# Altium schematic sheet jms578.SchDoc
size A2; SheetNumber: 2; SheetTotal: 4
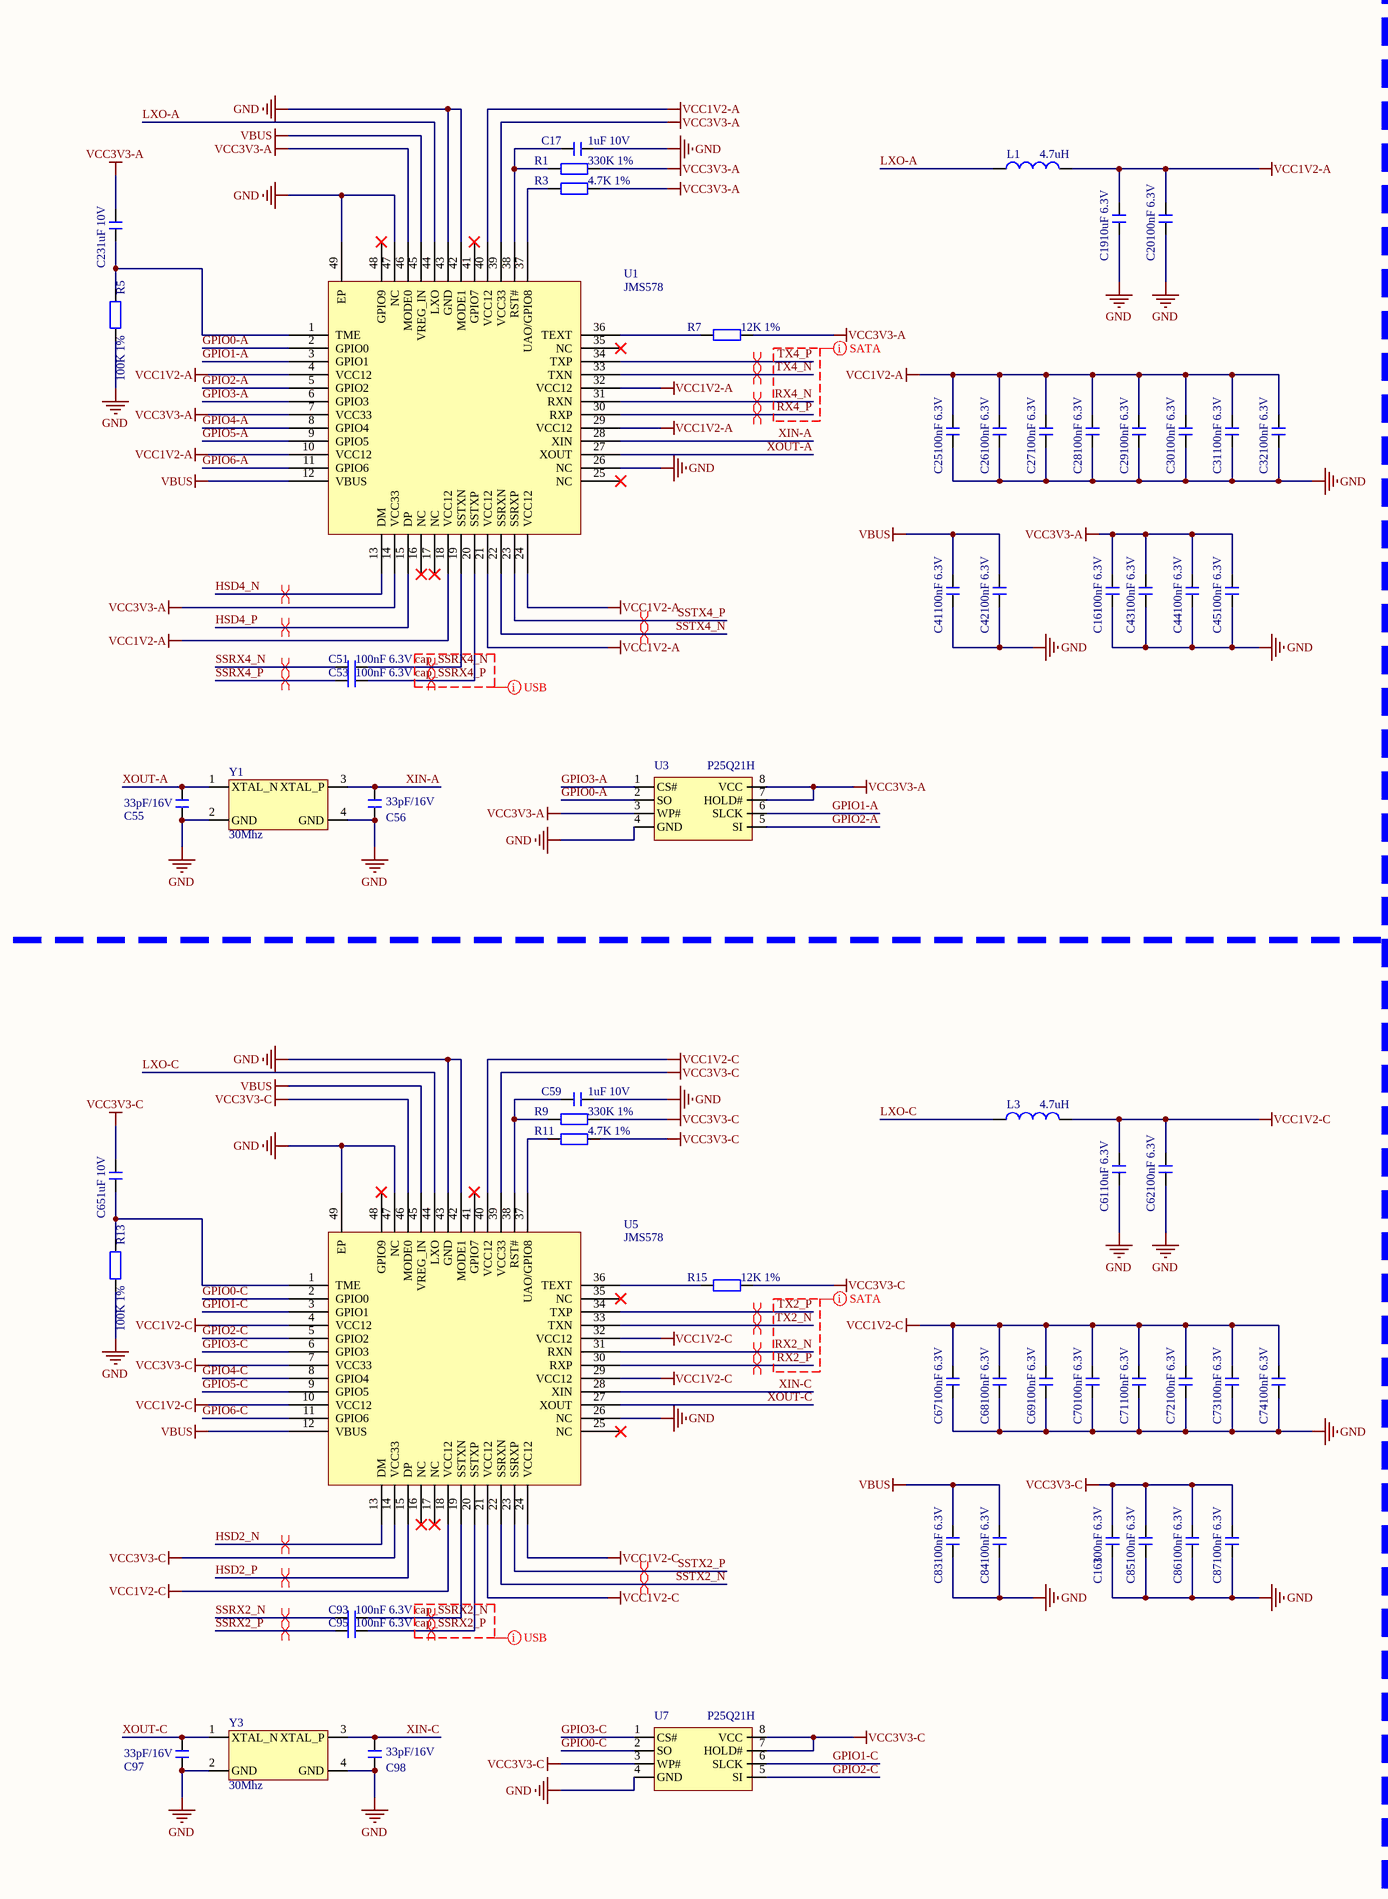
[diagram p0: jms578.SchDoc, left]
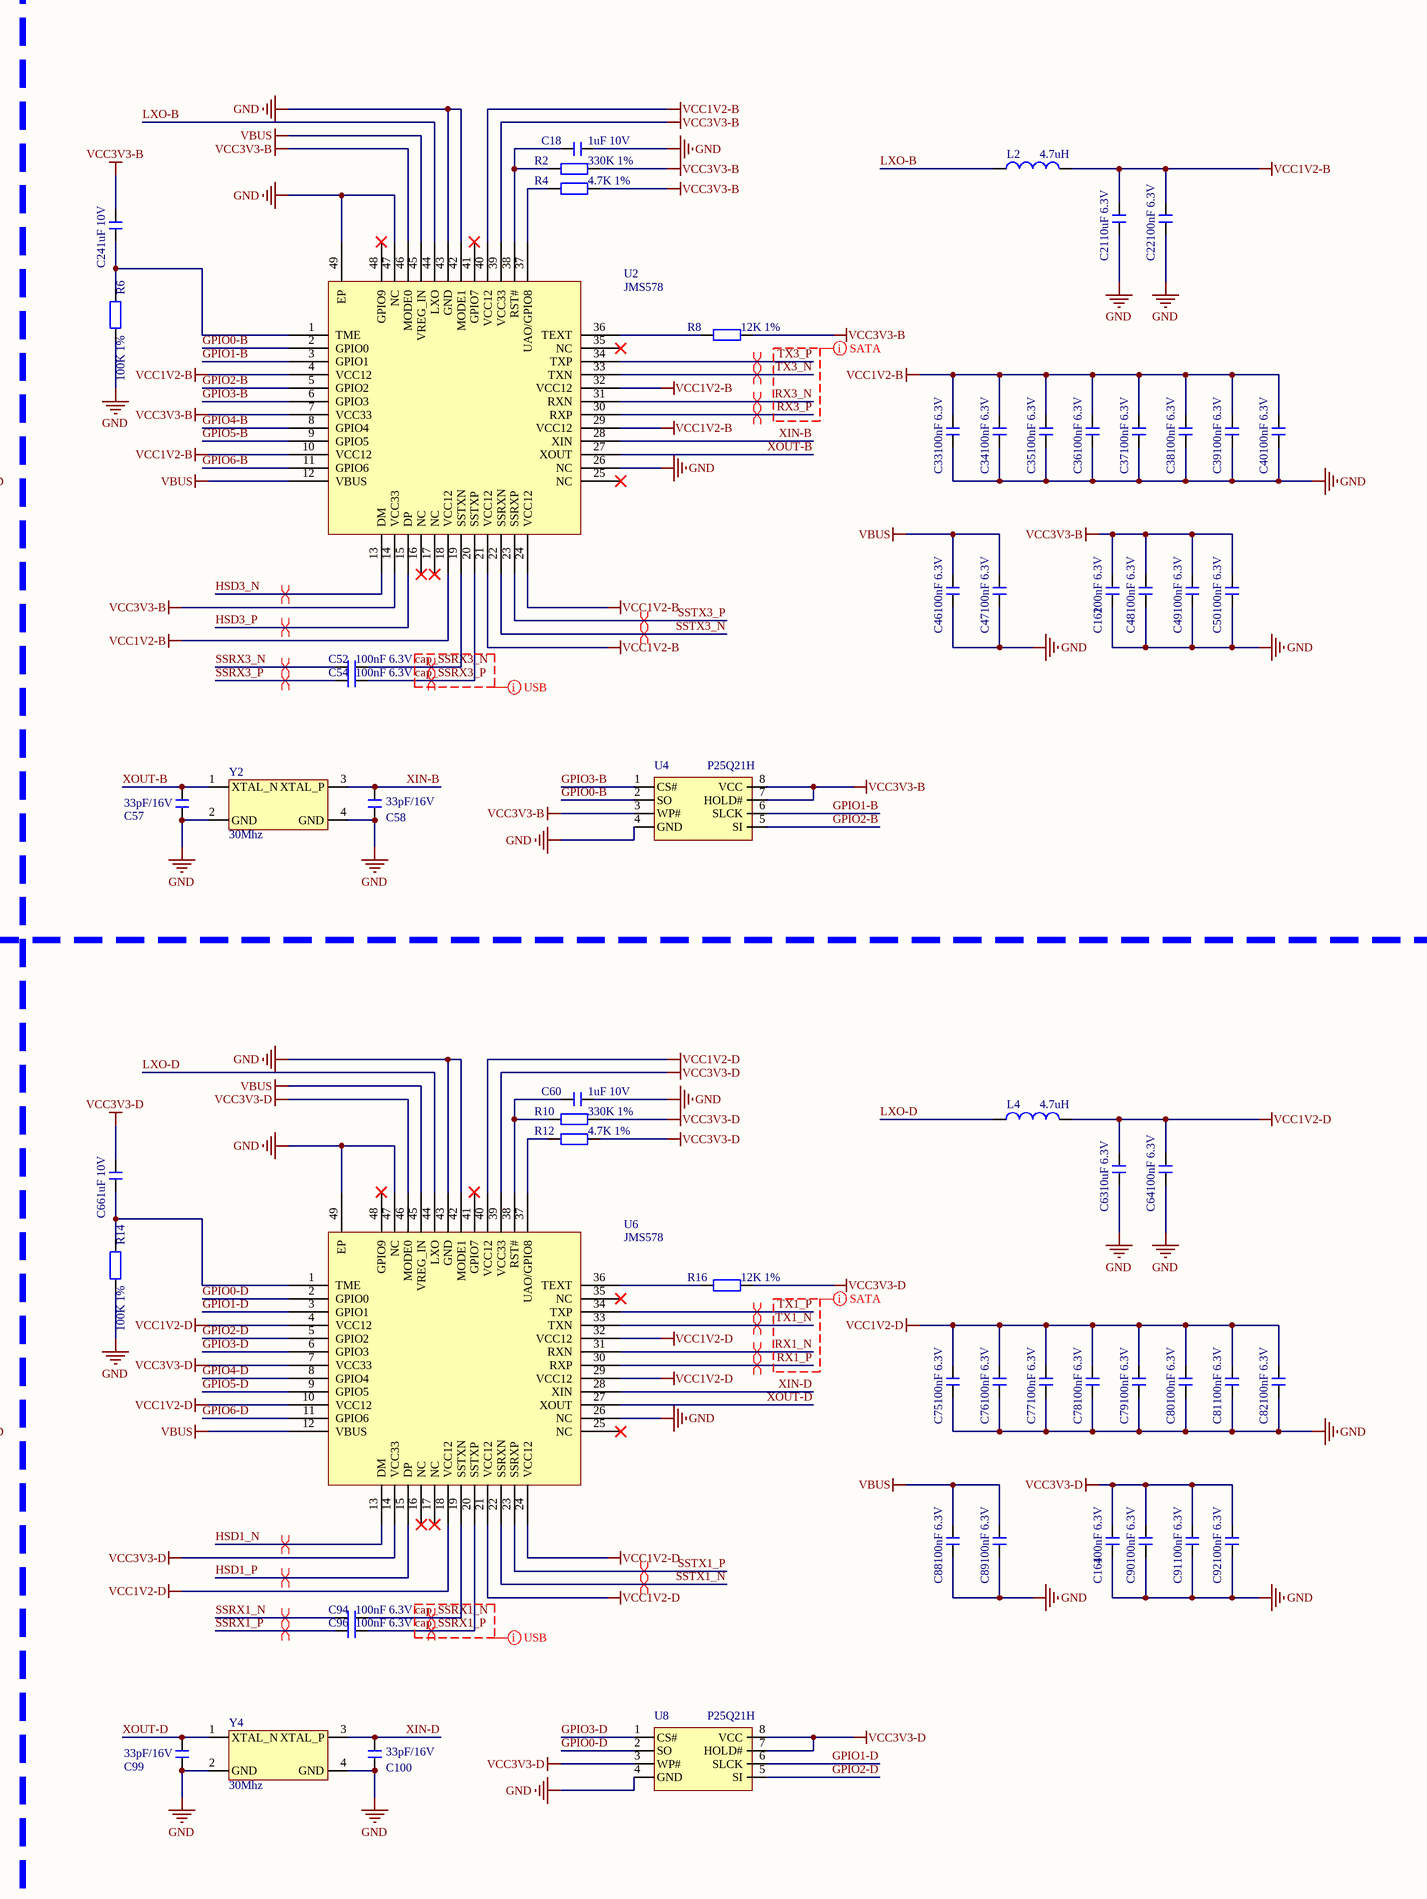
[diagram p1: jms578.SchDoc, right]

## Parts
C17  1uF 10V  [C0402_L]
C18  1uF 10V  [C0402_L]
C19  10uF 6.3V  [C0603_L]
C20  100nF 6.3V  [C0402_L]
C21  10uF 6.3V  [C0603_L]
C22  100nF 6.3V  [C0402_L]
C23  1uF 10V  [C0402_L]
C24  1uF 10V  [C0402_L]
C25  100nF 6.3V  [C0402_L]
C26  100nF 6.3V  [C0402_L]
C27  100nF 6.3V  [C0402_L]
C28  100nF 6.3V  [C0402_L]
C29  100nF 6.3V  [C0402_L]
C30  100nF 6.3V  [C0402_L]
C31  100nF 6.3V  [C0402_L]
C32  100nF 6.3V  [C0402_L]
C33  100nF 6.3V  [C0402_L]
C34  100nF 6.3V  [C0402_L]
C35  100nF 6.3V  [C0402_L]
C36  100nF 6.3V  [C0402_L]
C37  100nF 6.3V  [C0402_L]
C38  100nF 6.3V  [C0402_L]
C39  100nF 6.3V  [C0402_L]
C40  100nF 6.3V  [C0402_L]
C41  100nF 6.3V  [C0402_L]
C42  100nF 6.3V  [C0402_L]
C43  100nF 6.3V  [C0402_L]
C44  100nF 6.3V  [C0402_L]
C45  100nF 6.3V  [C0402_L]
C46  100nF 6.3V  [C0402_L]
C47  100nF 6.3V  [C0402_L]
C48  100nF 6.3V  [C0402_L]
C49  100nF 6.3V  [C0402_L]
C50  100nF 6.3V  [C0402_L]
C51  100nF 6.3V  [C0402_L]
C52  100nF 6.3V  [C0402_L]
C53  100nF 6.3V  [C0402_L]
C54  100nF 6.3V  [C0402_L]
C55  33pF/16V  [C0402_L]
C56  33pF/16V  [C0402_L]
C57  33pF/16V  [C0402_L]
C58  33pF/16V  [C0402_L]
C59  1uF 10V  [C0402_L]
C60  1uF 10V  [C0402_L]
C61  10uF 6.3V  [C0603_L]
C62  100nF 6.3V  [C0402_L]
C63  10uF 6.3V  [C0603_L]
C64  100nF 6.3V  [C0402_L]
C65  1uF 10V  [C0402_L]
C66  1uF 10V  [C0402_L]
C67  100nF 6.3V  [C0402_L]
C68  100nF 6.3V  [C0402_L]
C69  100nF 6.3V  [C0402_L]
C70  100nF 6.3V  [C0402_L]
C71  100nF 6.3V  [C0402_L]
C72  100nF 6.3V  [C0402_L]
C73  100nF 6.3V  [C0402_L]
C74  100nF 6.3V  [C0402_L]
C75  100nF 6.3V  [C0402_L]
C76  100nF 6.3V  [C0402_L]
C77  100nF 6.3V  [C0402_L]
C78  100nF 6.3V  [C0402_L]
C79  100nF 6.3V  [C0402_L]
C80  100nF 6.3V  [C0402_L]
C81  100nF 6.3V  [C0402_L]
C82  100nF 6.3V  [C0402_L]
C83  100nF 6.3V  [C0402_L]
C84  100nF 6.3V  [C0402_L]
C85  100nF 6.3V  [C0402_L]
C86  100nF 6.3V  [C0402_L]
C87  100nF 6.3V  [C0402_L]
C88  100nF 6.3V  [C0402_L]
C89  100nF 6.3V  [C0402_L]
C90  100nF 6.3V  [C0402_L]
C91  100nF 6.3V  [C0402_L]
C92  100nF 6.3V  [C0402_L]
C93  100nF 6.3V  [C0402_L]
C94  100nF 6.3V  [C0402_L]
C95  100nF 6.3V  [C0402_L]
C96  100nF 6.3V  [C0402_L]
C97  33pF/16V  [C0402_L]
C98  33pF/16V  [C0402_L]
C99  33pF/16V  [C0402_L]
C100  33pF/16V  [C0402_L]
C161  100nF 6.3V  [C0402_L]
C162  100nF 6.3V  [C0402_L]
C163  100nF 6.3V  [C0402_L]
C164  100nF 6.3V  [C0402_L]
L1  4.7uH  [NR2520]
L2  4.7uH  [NR2520]
L3  4.7uH  [NR2520]
L4  4.7uH  [NR2520]
R1  330K 1%  [R0402_L]
R2  330K 1%  [R0402_L]
R3  4.7K 1%  [R0402_L]
R4  4.7K 1%  [R0402_L]
R5  100K 1%  [R0402_L]
R6  100K 1%  [R0402_L]
R7  12K 1%  [R0402_L]
R8  12K 1%  [R0402_L]
R9  330K 1%  [R0402_L]
R10  330K 1%  [R0402_L]
R11  4.7K 1%  [R0402_L]
R12  4.7K 1%  [R0402_L]
R13  100K 1%  [R0402_L]
R14  100K 1%  [R0402_L]
R15  12K 1%  [R0402_L]
R16  12K 1%  [R0402_L]
U1  JMS578  [QFN48-L6.0-W6.0-P0.4]
U2  JMS578  [QFN48-L6.0-W6.0-P0.4]
U3  P25Q21H  [SOP8_L]
U4  P25Q21H  [SOP8_L]
U5  JMS578  [QFN48-L6.0-W6.0-P0.4]
U6  JMS578  [QFN48-L6.0-W6.0-P0.4]
U7  P25Q21H  [SOP8_L]
U8  P25Q21H  [SOP8_L]
Y1  30Mhz  [OSC 3225-4P]
Y2  30Mhz  [OSC 3225-4P]
Y3  30Mhz  [OSC 3225-4P]
Y4  30Mhz  [OSC 3225-4P]

## Nets
GND: C17.1 C18.1 C19.1 C20.1 C21.1 C22.1 C25.1 C26.1 C27.1 C28.1 C29.1 C30.1 C31.1 C32.1 C33.1 C34.1 C35.1 C36.1 C37.1 C38.1 C39.1 C40.1 C41.1 C42.1 C43.1 C44.1 C45.1 C46.1 C47.1 C48.1 C49.1 C50.1 C55.2 C56.2 C57.2 C58.2 C59.1 C60.1 C61.1 C62.1 C63.1 C64.1 C67.1 C68.1 C69.1 C70.1 C71.1 C72.1 C73.1 C74.1 C75.1 C76.1 C77.1 C78.1 C79.1 C80.1 C81.1 C82.1 C83.1 C84.1 C85.1 C86.1 C87.1 C88.1 C89.1 C90.1 C91.1 C92.1 C97.2 C98.2 C99.2 C100.2 C161.1 C162.1 C163.1 C164.1 R5.1 R6.1 R13.1 R14.1 U1.26(NC) U1.42(MODE1) U1.43(GND) U1.47(NC) U1.49(EP) U2.26(NC) U2.42(MODE1) U2.43(GND) U2.47(NC) U2.49(EP) U3.4(GND) U4.4(GND) U5.26(NC) U5.42(MODE1) U5.43(GND) U5.47(NC) U5.49(EP) U6.26(NC) U6.42(MODE1) U6.43(GND) U6.47(NC) U6.49(EP) U7.4(GND) U8.4(GND) Y1.2(GND) Y1.4(GND) Y2.2(GND) Y2.4(GND) Y3.2(GND) Y3.4(GND) Y4.2(GND) Y4.4(GND)
VBUS: C41.2 C42.2 C46.2 C47.2 C83.2 C84.2 C88.2 C89.2 U1.12(VBUS) U1.45(VREG_IN) U2.12(VBUS) U2.45(VREG_IN) U5.12(VBUS) U5.45(VREG_IN) U6.12(VBUS) U6.45(VREG_IN)
VCC1V2-A: C19.2 C20.2 C25.2 C26.2 C27.2 C28.2 C29.2 C30.2 C31.2 C32.2 L1.2 U1.4(VCC12) U1.10(VCC12) U1.18(VCC12) U1.21(VCC12) U1.24(VCC12) U1.29(VCC12) U1.32(VCC12) U1.40(VCC12)
VCC1V2-B: C21.2 C22.2 C33.2 C34.2 C35.2 C36.2 C37.2 C38.2 C39.2 C40.2 L2.2 U2.4(VCC12) U2.10(VCC12) U2.18(VCC12) U2.21(VCC12) U2.24(VCC12) U2.29(VCC12) U2.32(VCC12) U2.40(VCC12)
VCC1V2-C: C61.2 C62.2 C67.2 C68.2 C69.2 C70.2 C71.2 C72.2 C73.2 C74.2 L3.2 U5.4(VCC12) U5.10(VCC12) U5.18(VCC12) U5.21(VCC12) U5.24(VCC12) U5.29(VCC12) U5.32(VCC12) U5.40(VCC12)
VCC1V2-D: C63.2 C64.2 C75.2 C76.2 C77.2 C78.2 C79.2 C80.2 C81.2 C82.2 L4.2 U6.4(VCC12) U6.10(VCC12) U6.18(VCC12) U6.21(VCC12) U6.24(VCC12) U6.29(VCC12) U6.32(VCC12) U6.40(VCC12)
VCC3V3-A: C23.2 C43.2 C44.2 C45.2 C161.2 R1.1 R3.1 R7.1 U1.7(VCC33) U1.14(VCC33) U1.39(VCC33) U1.46(MODE0) U3.3(WP#) U3.7(HOLD#) U3.8(VCC)
VCC3V3-B: C24.2 C48.2 C49.2 C50.2 C162.2 R2.1 R4.1 R8.1 U2.7(VCC33) U2.14(VCC33) U2.39(VCC33) U2.46(MODE0) U4.3(WP#) U4.7(HOLD#) U4.8(VCC)
VCC3V3-C: C65.2 C85.2 C86.2 C87.2 C163.2 R9.1 R11.1 R15.1 U5.7(VCC33) U5.14(VCC33) U5.39(VCC33) U5.46(MODE0) U7.3(WP#) U7.7(HOLD#) U7.8(VCC)
VCC3V3-D: C66.2 C90.2 C91.2 C92.2 C164.2 R10.1 R12.1 R16.1 U6.7(VCC33) U6.14(VCC33) U6.39(VCC33) U6.46(MODE0) U8.3(WP#) U8.7(HOLD#) U8.8(VCC)
cap_SSRX1_N: C94.2 U6.19(SSTXN)
cap_SSRX1_P: C96.2 U6.20(SSTXP)
cap_SSRX2_N: C93.2 U5.19(SSTXN)
cap_SSRX2_P: C95.2 U5.20(SSTXP)
cap_SSRX3_N: C52.2 U2.19(SSTXN)
cap_SSRX3_P: C54.2 U2.20(SSTXP)
cap_SSRX4_N: C51.2 U1.19(SSTXN)
cap_SSRX4_P: C53.2 U1.20(SSTXP)
GPIO0-A: U1.2(GPIO0) U3.2(SO)
GPIO0-B: U2.2(GPIO0) U4.2(SO)
GPIO0-C: U5.2(GPIO0) U7.2(SO)
GPIO0-D: U6.2(GPIO0) U8.2(SO)
GPIO1-A: U1.3(GPIO1) U3.6(SLCK)
GPIO1-B: U2.3(GPIO1) U4.6(SLCK)
GPIO1-C: U5.3(GPIO1) U7.6(SLCK)
GPIO1-D: U6.3(GPIO1) U8.6(SLCK)
GPIO2-A: U1.5(GPIO2) U3.5(SI)
GPIO2-B: U2.5(GPIO2) U4.5(SI)
GPIO2-C: U5.5(GPIO2) U7.5(SI)
GPIO2-D: U6.5(GPIO2) U8.5(SI)
GPIO3-A: U1.6(GPIO3) U3.1(CS#)
GPIO3-B: U2.6(GPIO3) U4.1(CS#)
GPIO3-C: U5.6(GPIO3) U7.1(CS#)
GPIO3-D: U6.6(GPIO3) U8.1(CS#)
GPIO4-A: U1.8(GPIO4)
GPIO4-B: U2.8(GPIO4)
GPIO4-C: U5.8(GPIO4)
GPIO4-D: U6.8(GPIO4)
GPIO5-A: U1.9(GPIO5)
GPIO5-B: U2.9(GPIO5)
GPIO5-C: U5.9(GPIO5)
GPIO5-D: U6.9(GPIO5)
GPIO6-A: U1.11(GPIO6)
GPIO6-B: U2.11(GPIO6)
GPIO6-C: U5.11(GPIO6)
GPIO6-D: U6.11(GPIO6)
HSD1_N: U6.13(DM)
HSD1_P: U6.15(DP)
HSD2_N: U5.13(DM)
HSD2_P: U5.15(DP)
HSD3_N: U2.13(DM)
HSD3_P: U2.15(DP)
HSD4_N: U1.13(DM)
HSD4_P: U1.15(DP)
LXO-A: L1.1 U1.44(LXO)
LXO-B: L2.1 U2.44(LXO)
LXO-C: L3.1 U5.44(LXO)
LXO-D: L4.1 U6.44(LXO)
RX1_N: U6.31(RXN)
RX1_P: U6.30(RXP)
RX2_N: U5.31(RXN)
RX2_P: U5.30(RXP)
RX3_N: U2.31(RXN)
RX3_P: U2.30(RXP)
RX4_N: U1.31(RXN)
RX4_P: U1.30(RXP)
SSRX1_N: C94.1
SSRX1_P: C96.1
SSRX2_N: C93.1
SSRX2_P: C95.1
SSRX3_N: C52.1
SSRX3_P: C54.1
SSRX4_N: C51.1
SSRX4_P: C53.1
SSTX1_N: U6.22(SSRXN)
SSTX1_P: U6.23(SSRXP)
SSTX2_N: U5.22(SSRXN)
SSTX2_P: U5.23(SSRXP)
SSTX3_N: U2.22(SSRXN)
SSTX3_P: U2.23(SSRXP)
SSTX4_N: U1.22(SSRXN)
SSTX4_P: U1.23(SSRXP)
TX1_N: U6.33(TXN)
TX1_P: U6.34(TXP)
TX2_N: U5.33(TXN)
TX2_P: U5.34(TXP)
TX3_N: U2.33(TXN)
TX3_P: U2.34(TXP)
TX4_N: U1.33(TXN)
TX4_P: U1.34(TXP)
XIN-A: C56.1 U1.28(XIN) Y1.3(XTAL_P)
XIN-B: C58.1 U2.28(XIN) Y2.3(XTAL_P)
XIN-C: C98.1 U5.28(XIN) Y3.3(XTAL_P)
XIN-D: C100.1 U6.28(XIN) Y4.3(XTAL_P)
XOUT-A: C55.1 U1.27(XOUT) Y1.1(XTAL_N)
XOUT-B: C57.1 U2.27(XOUT) Y2.1(XTAL_N)
XOUT-C: C97.1 U5.27(XOUT) Y3.1(XTAL_N)
XOUT-D: C99.1 U6.27(XOUT) Y4.1(XTAL_N)
NetC17_2: C17.2 R1.2 U1.38(RST#)
NetC18_2: C18.2 R2.2 U2.38(RST#)
NetC23_1: C23.1 R5.2 U1.1(TME)
NetC24_1: C24.1 R6.2 U2.1(TME)
NetC59_2: C59.2 R9.2 U5.38(RST#)
NetC60_2: C60.2 R10.2 U6.38(RST#)
NetC65_1: C65.1 R13.2 U5.1(TME)
NetC66_1: C66.1 R14.2 U6.1(TME)
NetR3_2: R3.2 U1.37(UAO/GPIO8)
NetR4_2: R4.2 U2.37(UAO/GPIO8)
NetR7_2: R7.2 U1.36(TEXT)
NetR8_2: R8.2 U2.36(TEXT)
NetR11_2: R11.2 U5.37(UAO/GPIO8)
NetR12_2: R12.2 U6.37(UAO/GPIO8)
NetR15_2: R15.2 U5.36(TEXT)
NetR16_2: R16.2 U6.36(TEXT)

Not connected (* = marked no-connect by the designer): U1 16(NC)* 17(NC)* 25(NC)* 35(NC)* 41(GPIO7)* 48(GPIO9)*; U2 16(NC)* 17(NC)* 25(NC)* 35(NC)* 41(GPIO7)* 48(GPIO9)*; U5 16(NC)* 17(NC)* 25(NC)* 35(NC)* 41(GPIO7)* 48(GPIO9)*; U6 16(NC)* 17(NC)* 25(NC)* 35(NC)* 41(GPIO7)* 48(GPIO9)*

## Layout directives
differential pair: cap_SSRX1_N, cap_SSRX1_P, cap_SSRX2_N, cap_SSRX2_P, cap_SSRX3_N, cap_SSRX3_P, cap_SSRX4_N, cap_SSRX4_P, HSD1_N, HSD1_P, HSD2_N, HSD2_P, HSD3_N, HSD3_P, HSD4_N, HSD4_P, RX1_N, RX1_P, RX2_N, RX2_P, RX3_N, RX3_P, RX4_N, RX4_P, SSRX1_N, SSRX1_P, SSRX2_N, SSRX2_P, SSRX3_N, SSRX3_P, SSRX4_N, SSRX4_P, SSTX1_N, SSTX1_P, SSTX2_N, SSTX2_P, SSTX3_N, SSTX3_P, SSTX4_N, SSTX4_P, TX1_N, TX1_P, TX2_N, TX2_P, TX3_N, TX3_P, TX4_N, TX4_P
net class USB; rule Differential Pairs Routing [Pref Gap = 4mil    Min Gap  = 4mil    Max Gap  = 4milPref Width = 5.15mil    Min Width  = 5.15mil    Max Width  = 5.15mil]: cap_SSRX1_N, cap_SSRX1_P, cap_SSRX2_N, cap_SSRX2_P, cap_SSRX3_N, cap_SSRX3_P, cap_SSRX4_N, cap_SSRX4_P
net class SATA; rule Differential Pairs Routing [Pref Gap = 6mil    Min Gap  = 6mil    Max Gap  = 6milPref Width = 4.29mil    Min Width  = 4.29mil    Max Width  = 4.29mil]: RX1_N, RX1_P, RX2_N, RX2_P, RX3_N, RX3_P, RX4_N, RX4_P, TX1_N, TX1_P, TX2_N, TX2_P, TX3_N, TX3_P, TX4_N, TX4_P

## Library data of the parts
C17-C100 C161-C164 = C: 无极性贴片电容; 版权归属: 源创客; 材质: X7R; BOM名称: 无极性贴片电容; 学习资源: www.ooocke.com
L1-L4 = L: 小功率贴片电感; 版权归属: 源创客; BOM名称: 小功率贴片电感; 学习资源: www.ooocke.com
R1-R16 = R: 贴片电阻; 版权归属: 源创客; BOM名称: 贴片电阻; 学习资源: www.ooocke.com
U3 U4 U7 U8 = P25D40H
Y1-Y4 = Crystal